# Altium schematic sheet Sheet.SchDoc
size A2
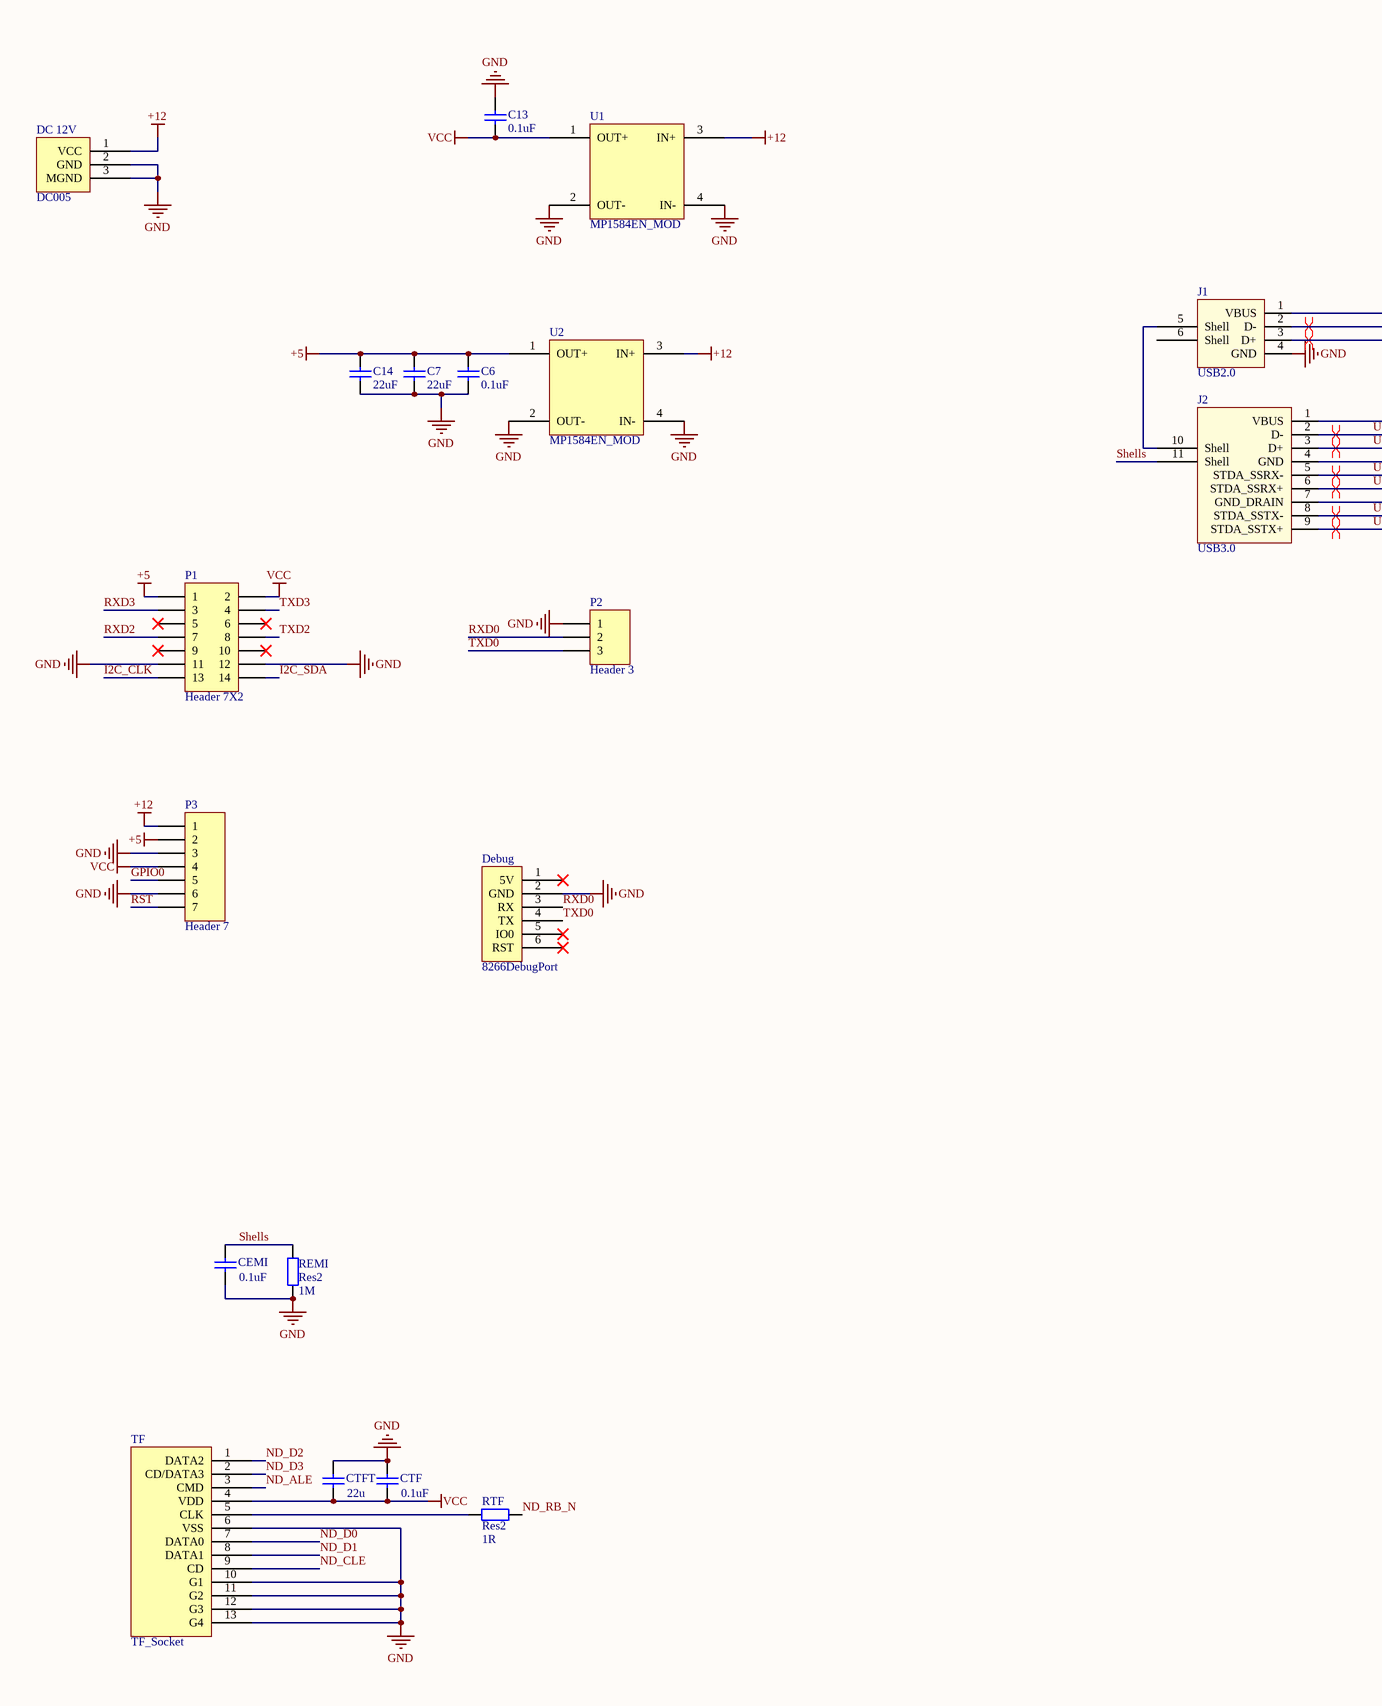
[diagram p0: Sheet.SchDoc, left]
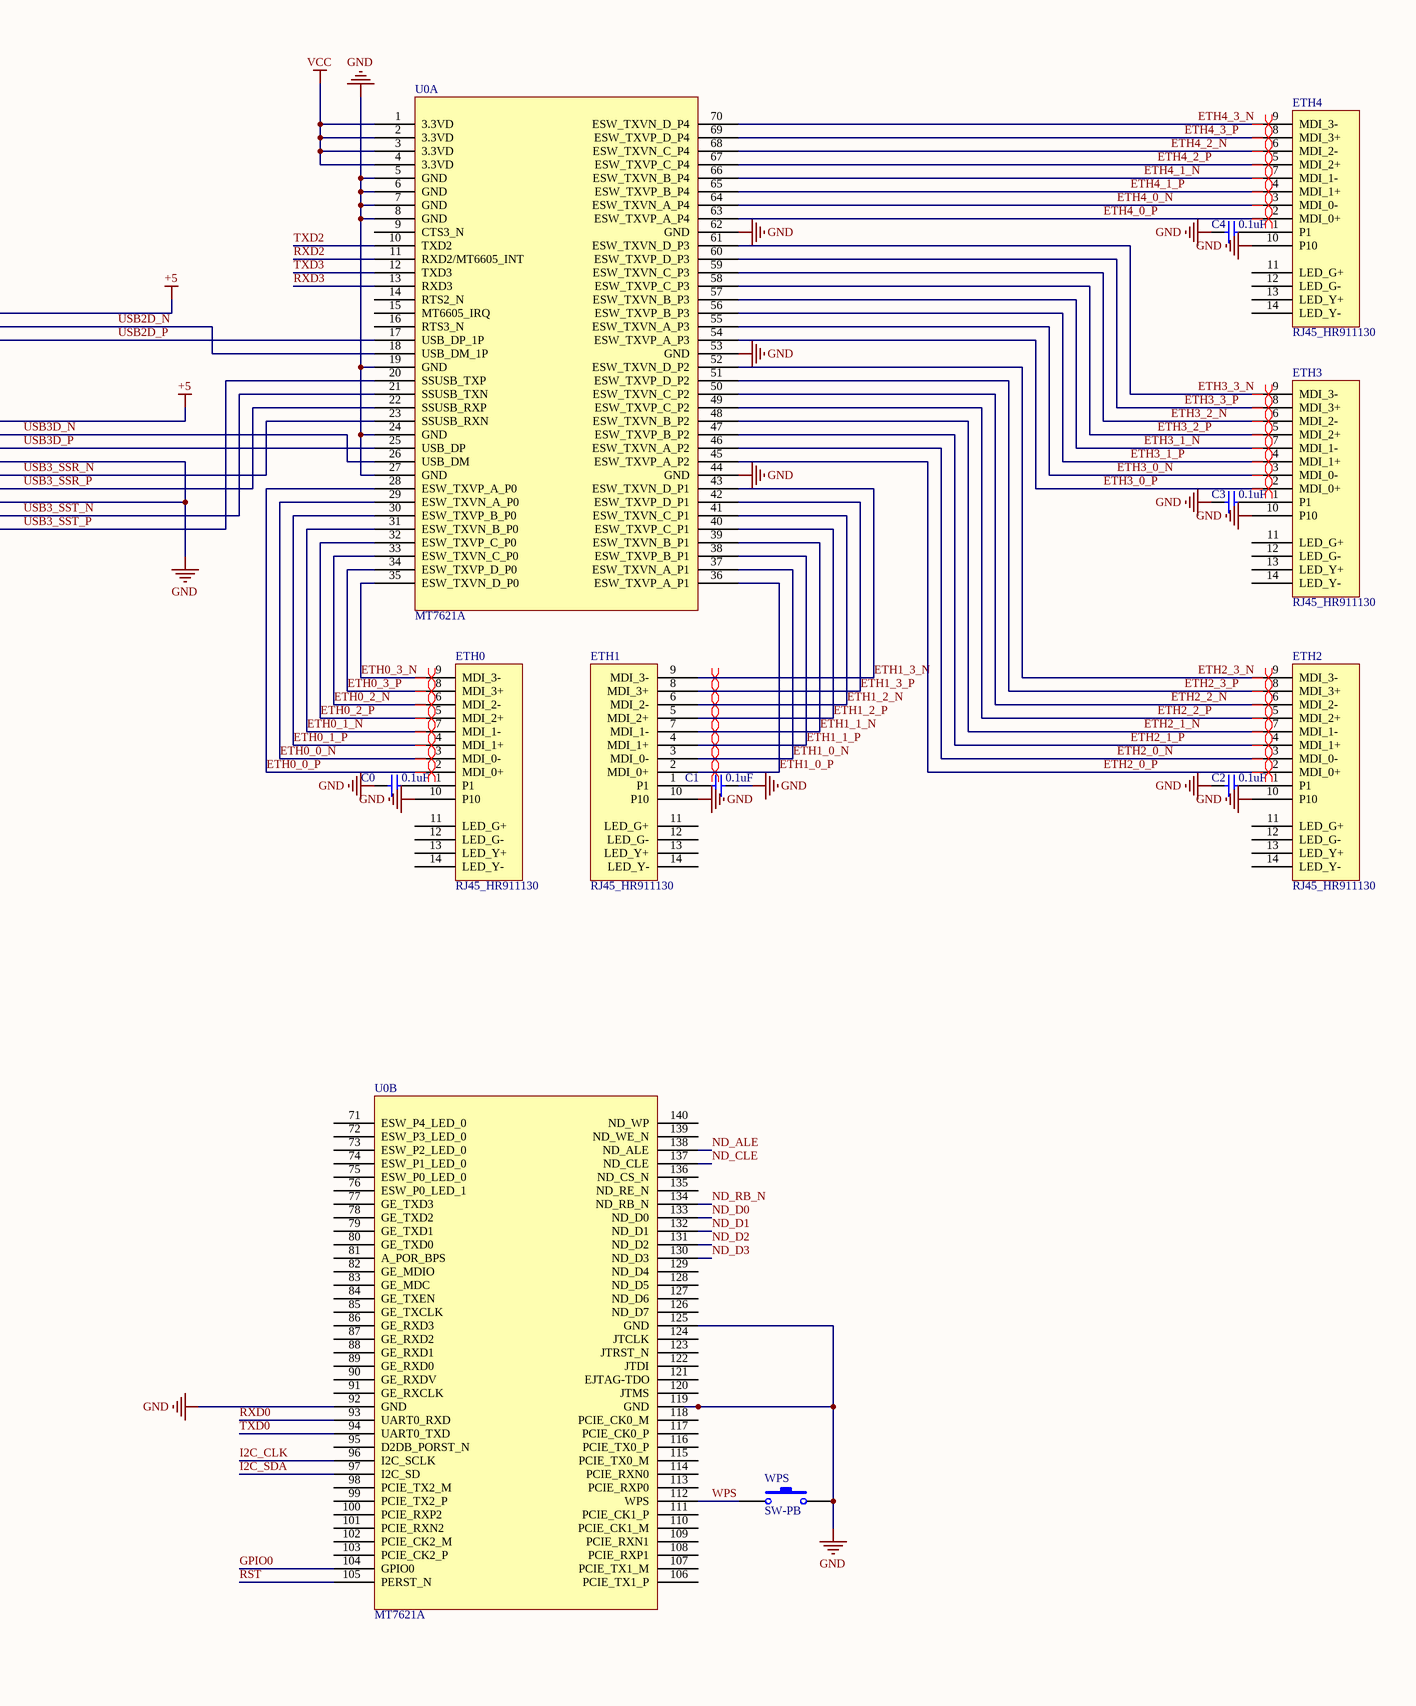
[diagram p1: Sheet.SchDoc, right]

## Parts
C0  value 0.1uF  [My1206]  (hidden comment: Cap)
C1  value 0.1uF  [My1206]  (hidden comment: Cap)
C2  value 0.1uF  [My1206]  (hidden comment: Cap)
C3  value 0.1uF  [My1206]  (hidden comment: Cap)
C4  value 0.1uF  [My1206]  (hidden comment: Cap)
C6  value 0.1uF  [My1206]  (hidden comment: Cap)
C7  value 22uF  [My1206]  (hidden comment: Cap)
C13  value 0.1uF  [My1206]  (hidden comment: Cap)
C14  value 22uF  [My1206]  (hidden comment: Cap)
CEMI  value 0.1uF  [My1206]  (hidden comment: Cap)
CTF  value 0.1uF  [My1206]  (hidden comment: Cap)
CTFT  value 22u  [My1206]  (hidden comment: Cap)
DC_12V  DC005  [DC-005]
Debug  8266DebugPort  [XH2.54-LI-6P]
ETH0  RJ45_HR911130  [RJ45_HR911130]
ETH1  RJ45_HR911130  [RJ45_HR911130]
ETH2  RJ45_HR911130  [RJ45_HR911130]
ETH3  RJ45_HR911130  [RJ45_HR911130]
ETH4  RJ45_HR911130  [RJ45_HR911130]
J1  USB2.0  [USB2.0]
J2  USB3.0  [USB3.0_0]
P1  Header 7X2  [IDC3-7*2]
P2  Header 3  [HDR1X3]
P3  Header 7  [XH2.54-LI-7P]
REMI  Res2  value 1M  [My1206]
RTF  Res2  value 1R  [My1206]
TF  TF_Socket  [TF_Socket]
U0  MT7621A  [HLK7621]  (parts A,B of 2)
U1  MP1584EN_MOD  [MP1584EN_MOD]
U2  MP1584EN_MOD  [MP1584EN_MOD]
WPS  SW-PB  [TSW SMD-3*6*2.5]

## Nets
+5: C6.1 C7.1 C14.1 J1.1(VBUS) J2.1(VBUS) P1.1 P3.2 U2.1(OUT+)
+12: DC_12V.1(VCC) P3.1 U1.3(IN+) U2.3(IN+)
GND: C0.2 C1.1 C2.2 C3.2 C4.2 C6.2 C7.2 C13.1 C14.2 CEMI.1 CTF.2 CTFT.2 DC_12V.2(GND) DC_12V.3(MGND) Debug.2(GND) ETH0.10(P10) ETH1.10(P10) ETH2.10(P10) ETH3.10(P10) ETH4.10(P10) J1.4(GND) J2.4(GND) J2.7(GND_DRAIN) P1.11 P1.12 P2.1 P3.3 P3.6 REMI.1 TF.6(VSS) TF.10(G1) TF.11(G2) TF.12(G3) TF.13(G4) U0.5(GND) U0.6(GND) U0.7(GND) U0.8(GND) U0.19(GND) U0.24(GND) U0.27(GND) U0.44(GND) U0.53(GND) U0.62(GND) U0.92(GND) U0.119(GND) U0.125(GND) U1.2(OUT-) U1.4(IN-) U2.2(OUT-) U2.4(IN-) WPS.2
VCC: C13.2 CTF.1 CTFT.1 P1.2 P3.4 TF.4(VDD) U0.1(3.3VD) U0.2(3.3VD) U0.3(3.3VD) U0.4(3.3VD) U1.1(OUT+)
ETH0_0_N: ETH0.3(MDI_0-) U0.29(ESW_TXVN_A_P0)
ETH0_0_P: ETH0.2(MDI_0+) U0.28(ESW_TXVP_A_P0)
ETH0_1_N: ETH0.7(MDI_1-) U0.31(ESW_TXVN_B_P0)
ETH0_1_P: ETH0.4(MDI_1+) U0.30(ESW_TXVP_B_P0)
ETH0_2_N: ETH0.6(MDI_2-) U0.33(ESW_TXVN_C_P0)
ETH0_2_P: ETH0.5(MDI_2+) U0.32(ESW_TXVP_C_P0)
ETH0_3_N: ETH0.9(MDI_3-) U0.35(ESW_TXVN_D_P0)
ETH0_3_P: ETH0.8(MDI_3+) U0.34(ESW_TXVP_D_P0)
ETH1_0_N: ETH1.3(MDI_0-) U0.37(ESW_TXVN_A_P1)
ETH1_0_P: ETH1.2(MDI_0+) U0.36(ESW_TXVP_A_P1)
ETH1_1_N: ETH1.7(MDI_1-) U0.39(ESW_TXVN_B_P1)
ETH1_1_P: ETH1.4(MDI_1+) U0.38(ESW_TXVP_B_P1)
ETH1_2_N: ETH1.6(MDI_2-) U0.41(ESW_TXVN_C_P1)
ETH1_2_P: ETH1.5(MDI_2+) U0.40(ESW_TXVP_C_P1)
ETH1_3_N: ETH1.9(MDI_3-) U0.43(ESW_TXVN_D_P1)
ETH1_3_P: ETH1.8(MDI_3+) U0.42(ESW_TXVP_D_P1)
ETH2_0_N: ETH2.3(MDI_0-) U0.46(ESW_TXVN_A_P2)
ETH2_0_P: ETH2.2(MDI_0+) U0.45(ESW_TXVP_A_P2)
ETH2_1_N: ETH2.7(MDI_1-) U0.48(ESW_TXVN_B_P2)
ETH2_1_P: ETH2.4(MDI_1+) U0.47(ESW_TXVP_B_P2)
ETH2_2_N: ETH2.6(MDI_2-) U0.50(ESW_TXVN_C_P2)
ETH2_2_P: ETH2.5(MDI_2+) U0.49(ESW_TXVP_C_P2)
ETH2_3_N: ETH2.9(MDI_3-) U0.52(ESW_TXVN_D_P2)
ETH2_3_P: ETH2.8(MDI_3+) U0.51(ESW_TXVP_D_P2)
ETH3_0_N: ETH3.3(MDI_0-) U0.55(ESW_TXVN_A_P3)
ETH3_0_P: ETH3.2(MDI_0+) U0.54(ESW_TXVP_A_P3)
ETH3_1_N: ETH3.7(MDI_1-) U0.57(ESW_TXVN_B_P3)
ETH3_1_P: ETH3.4(MDI_1+) U0.56(ESW_TXVP_B_P3)
ETH3_2_N: ETH3.6(MDI_2-) U0.59(ESW_TXVN_C_P3)
ETH3_2_P: ETH3.5(MDI_2+) U0.58(ESW_TXVP_C_P3)
ETH3_3_N: ETH3.9(MDI_3-) U0.61(ESW_TXVN_D_P3)
ETH3_3_P: ETH3.8(MDI_3+) U0.60(ESW_TXVP_D_P3)
ETH4_0_N: ETH4.3(MDI_0-) U0.64(ESW_TXVN_A_P4)
ETH4_0_P: ETH4.2(MDI_0+) U0.63(ESW_TXVP_A_P4)
ETH4_1_N: ETH4.7(MDI_1-) U0.66(ESW_TXVN_B_P4)
ETH4_1_P: ETH4.4(MDI_1+) U0.65(ESW_TXVP_B_P4)
ETH4_2_N: ETH4.6(MDI_2-) U0.68(ESW_TXVN_C_P4)
ETH4_2_P: ETH4.5(MDI_2+) U0.67(ESW_TXVP_C_P4)
ETH4_3_N: ETH4.9(MDI_3-) U0.70(ESW_TXVN_D_P4)
ETH4_3_P: ETH4.8(MDI_3+) U0.69(ESW_TXVP_D_P4)
GPIO0: P3.5 U0.104(GPIO0)
I2C_CLK: P1.13 U0.96(I2C_SCLK)
I2C_SDA: P1.14 U0.97(I2C_SD)
ND_ALE: TF.3(CMD) U0.138(ND_ALE)
ND_CLE: TF.9(CD) U0.137(ND_CLE)
ND_D0: TF.7(DATA0) U0.133(ND_D0)
ND_D1: TF.8(DATA1) U0.132(ND_D1)
ND_D2: TF.1(DATA2) U0.131(ND_D2)
ND_D3: TF.2(CD/DATA3) U0.130(ND_D3)
ND_RB_N: RTF.1 U0.134(ND_RB_N)
RST: P3.7 U0.105(PERST_N)
RXD0: Debug.3(RX) P2.2 U0.93(UART0_RXD)
RXD2: P1.7 U0.11(RXD2/MT6605_INT)
RXD3: P1.3 U0.13(RXD3)
Shells: CEMI.2 J2.11(Shell) REMI.2
TXD0: Debug.4(TX) P2.3 U0.94(UART0_TXD)
TXD2: P1.8 U0.10(TXD2)
TXD3: P1.4 U0.12(TXD3)
USB2D_N: J1.2(D-) U0.18(USB_DM_1P)
USB2D_P: J1.3(D+) U0.17(USB_DP_1P)
USB3_SSR_N: J2.5(STDA_SSRX-) U0.23(SSUSB_RXN)
USB3_SSR_P: J2.6(STDA_SSRX+) U0.22(SSUSB_RXP)
USB3_SST_N: J2.8(STDA_SSTX-) U0.21(SSUSB_TXN)
USB3_SST_P: J2.9(STDA_SSTX+) U0.20(SSUSB_TXP)
USB3D_N: J2.2(D-) U0.26(USB_DM)
USB3D_P: J2.3(D+) U0.25(USB_DP)
WPS: U0.112(WPS) WPS.1
NetC0_1: C0.1 ETH0.1(P1)
NetC1_2: C1.2 ETH1.1(P1)
NetC2_1: C2.1 ETH2.1(P1)
NetC3_1: C3.1 ETH3.1(P1)
NetC4_1: C4.1 ETH4.1(P1)
NetJ1_5: J1.5(Shell) J2.10(Shell)
NetRTF_2: RTF.2 TF.5(CLK)

Not connected (* = marked no-connect by the designer): Debug 1(5V)* 5(IO0)* 6(RST)*; ETH0 11(LED_G+) 12(LED_G-) 13(LED_Y+) 14(LED_Y-); ETH1 11(LED_G+) 12(LED_G-) 13(LED_Y+) 14(LED_Y-); ETH2 11(LED_G+) 12(LED_G-) 13(LED_Y+) 14(LED_Y-); ETH3 11(LED_G+) 12(LED_G-) 13(LED_Y+) 14(LED_Y-); ETH4 11(LED_G+) 12(LED_G-) 13(LED_Y+) 14(LED_Y-); J1 6(Shell); P1 5* 6* 9* 10*; U0 9(CTS3_N) 14(RTS2_N) 15(MT6605_IRQ) 16(RTS3_N) 71(ESW_P4_LED_0) 72(ESW_P3_LED_0) 73(ESW_P2_LED_0) 74(ESW_P1_LED_0) 75(ESW_P0_LED_0) 76(ESW_P0_LED_1) 77(GE_TXD3) 78(GE_TXD2) 79(GE_TXD1) 80(GE_TXD0) 81(A_POR_BPS) 82(GE_MDIO) 83(GE_MDC) 84(GE_TXEN) 85(GE_TXCLK) 86(GE_RXD3) 87(GE_RXD2) 88(GE_RXD1) 89(GE_RXD0) 90(GE_RXDV) 91(GE_RXCLK) 95(D2DB_PORST_N) 98(PCIE_TX2_M) 99(PCIE_TX2_P) 100(PCIE_RXP2) 101(PCIE_RXN2) 102(PCIE_CK2_M) 103(PCIE_CK2_P) 106(PCIE_TX1_P) 107(PCIE_TX1_M) 108(PCIE_RXP1) 109(PCIE_RXN1) 110(PCIE_CK1_M) 111(PCIE_CK1_P) 113(PCIE_RXP0) 114(PCIE_RXN0) 115(PCIE_TX0_M) 116(PCIE_TX0_P) 117(PCIE_CK0_P) 118(PCIE_CK0_M) 120(JTMS) 121(EJTAG-TDO) 122(JTDI) 123(JTRST_N) 124(JTCLK) 126(ND_D7) 127(ND_D6) 128(ND_D5) 129(ND_D4) 135(ND_RE_N) 136(ND_CS_N) 139(ND_WE_N) 140(ND_WP)

## Layout directives
differential pair: ETH0_0_N, ETH0_0_P, ETH0_1_N, ETH0_1_P, ETH0_2_N, ETH0_2_P, ETH0_3_N, ETH0_3_P, ETH1_0_N, ETH1_0_P, ETH1_1_N, ETH1_1_P, ETH1_2_N, ETH1_2_P, ETH1_3_N, ETH1_3_P, ETH2_0_N, ETH2_0_P, ETH2_1_N, ETH2_1_P, ETH2_2_N, ETH2_2_P, ETH2_3_N, ETH2_3_P, ETH3_0_N, ETH3_0_P, ETH3_1_N, ETH3_1_P, ETH3_2_N, ETH3_2_P, ETH3_3_N, ETH3_3_P, ETH4_0_N, ETH4_0_P, ETH4_1_N, ETH4_1_P, ETH4_2_N, ETH4_2_P, ETH4_3_N, ETH4_3_P, USB2D_N, USB2D_P, USB3_SSR_N, USB3_SSR_P, USB3_SST_N, USB3_SST_P, USB3D_N, USB3D_P

## Library data of the parts
C0-C4 C6 C7 C13 C14 CEMI CTF CTFT = Cap: Capacitor; Published: 8-Jun-2000; LatestRevisionDate: 17-Jul-2002; LatestRevisionNote: Re-released for DXP Platform.; PackageReference: RAD-0.3; Publisher: Altium Limited; PackageDescription: Radial Cap, Thru-Hole; 2 Leads; 0.3 in Pin Spacing
P1 = Header 7X2: Header, 7-Pin, Dual row; LatestRevisionDate: 17-Jul-2002; LatestRevisionNote: Re-released for DXP Platform.; Publisher: Altium Limited
P2 = Header 3: Header, 3-Pin; LatestRevisionDate: 17-Jul-2002; LatestRevisionNote: Re-released for DXP Platform.; Publisher: Altium Limited
P3 = Header 7: Header, 7-Pin; LatestRevisionDate: 17-Jul-2002; LatestRevisionNote: Re-released for DXP Platform.; Publisher: Altium Limited
REMI RTF = Res2: Resistor; Published: 8-Jun-2000; LatestRevisionDate: 17-Jul-2002; LatestRevisionNote: Re-released for DXP Platform.; PackageReference: AXIAL-0.4; Publisher: Altium Limited; PackageDescription: Axial Device, Thru-Hole; 2 Leads; 0.4 in Pin Spacing
WPS = SW-PB: Switch; Published: 24-Mar-1999; LatestRevisionDate: 17-Jul-2002; LatestRevisionNote: Re-released for DXP Platform.; PackageReference: SPST-2; Publisher: Altium Limited; PackageDescription: Switch; 2 Leads